# EAGLE design Card (EAGLE 9.6.2)
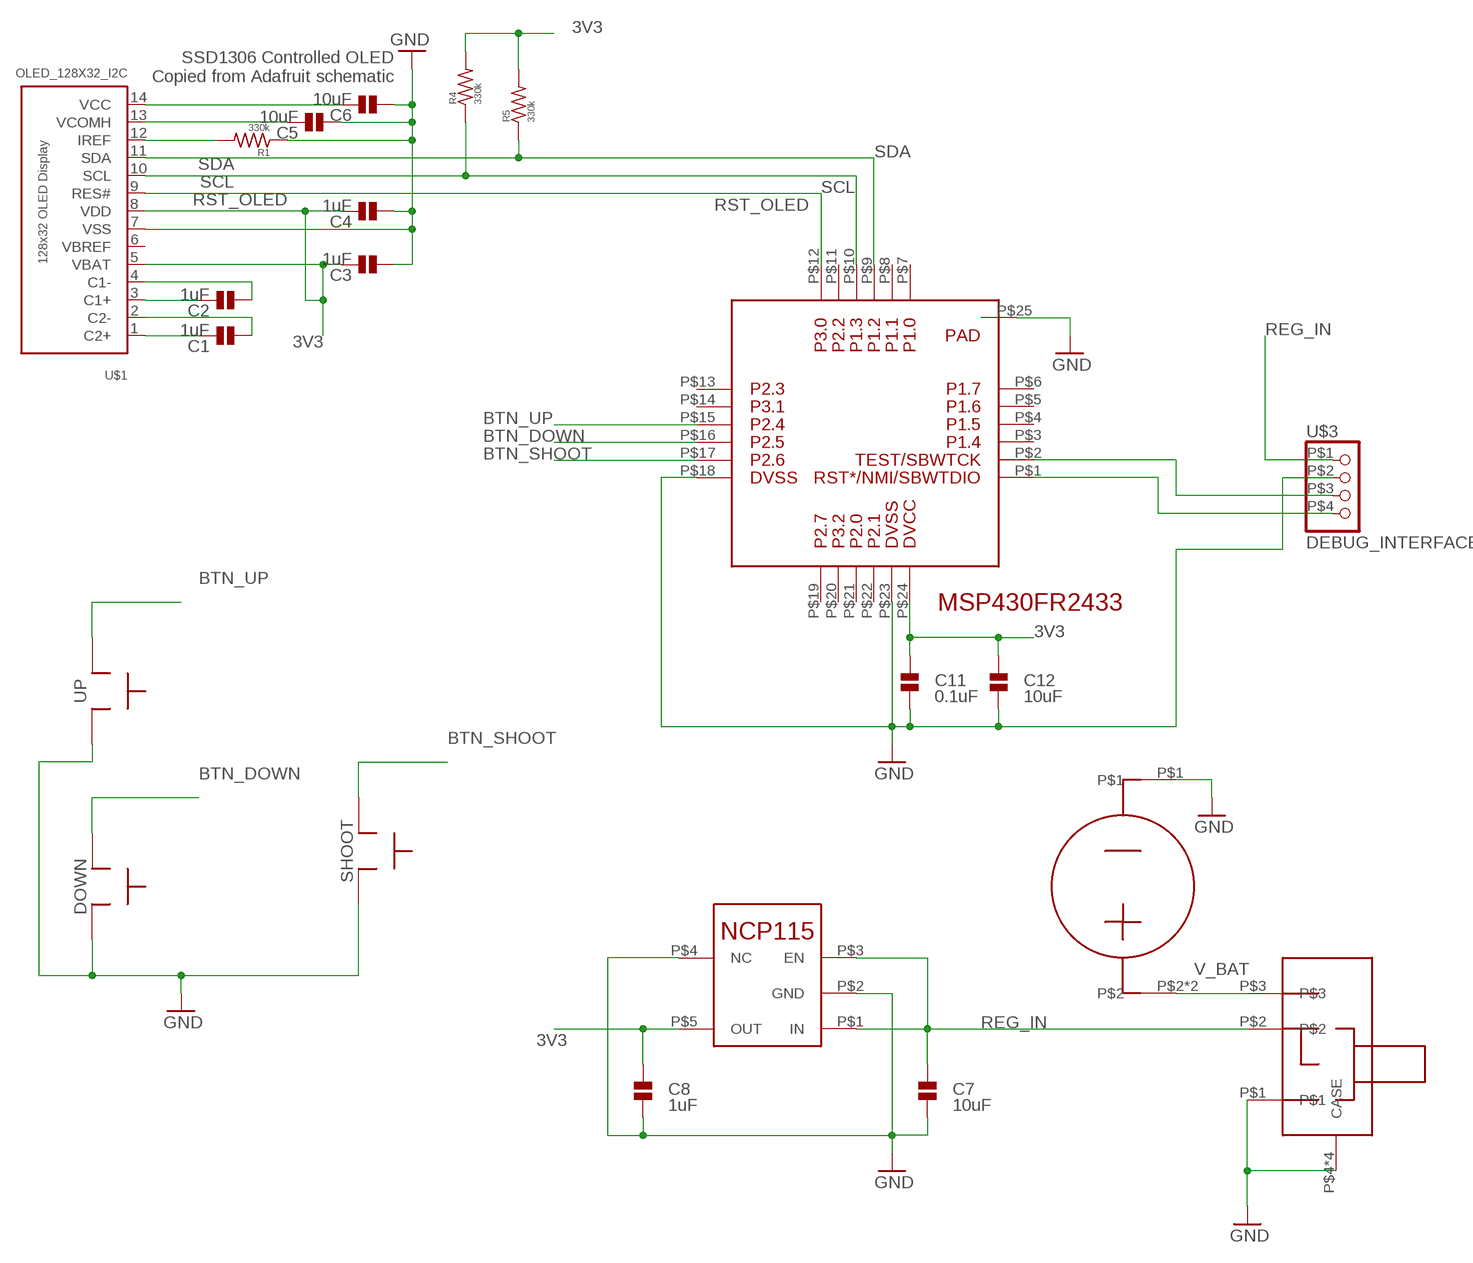
[diagram p0: schematic, sheet 1]

## Parts
C1  1uF  C-0603  [0603]
C2  1uF  C-0603  [0603]
C3  1uF  C-0603  [0603]
C4  1uF  C-0603  [0603]
C5  10uF  C-0603  [0603]
C6  10uF  C-0603  [0603]
C7  10uF  C-0603  [0603]
C8  1uF  C-0603  [0603]
C11  0.1uF  C-0603  [0603]
C12  10uF  C-0603  [0603]
DOWN  EVQ-Q2B02W  [EVQQ2]
R1  330k  R-0603  [0603]
R4  330k  R-0603  [0603]
R5  330k  R-0603  [0603]
SHOOT  EVQ-Q2B02W  [EVQQ2]
U$1  OLED_128X32_I2C  [OLED_I2C]
U$2  MSP430FR2433-VQFN  [VQFN-24]
U$3  DEBUG_INTERFACE  [DEBUG_INTERFACE_6PIN]
U$4  BAT-HLD-001  [BAT-HLD-001]
U$5  CUS-12TB  [CUS-12B]
U$6  NCP115  [TSOP-5]
UP  EVQ-Q2B02W  [EVQQ2]

## Nets
3V3: C3.2 C4.2 C8.2 C11.2 C12.2 R4.2 R5.2 U$1.5(VBAT) U$1.8(VDD) U$2.P$24 U$6.P$5(OUT)
BTN_DOWN: DOWN.P$1_A DOWN.P$2_A U$2.P$16
BTN_SHOOT: SHOOT.P$1_A SHOOT.P$2_A U$2.P$17
BTN_UP: U$2.P$15 UP.P$1_A UP.P$2_A
GND: C3.1 C4.1 C5.1 C6.1 C7.1 C8.1 C11.1 C12.1 DOWN.P$3_B DOWN.P$4_B R1.1 SHOOT.P$3_B SHOOT.P$4_B U$1.7(VSS) U$2.P$18 U$2.P$23 U$2.P$25 U$3.P$2 U$4.P$1 U$5.P$1 U$5.P$4(CASE) U$5.P$5(CASE) U$5.P$6(CASE) U$5.P$7(CASE) U$6.P$2(GND) U$6.P$4(NC) UP.P$3_B UP.P$4_B
N$1: C1.2 U$1.1(C2+)
N$2: C1.1 U$1.2(C2-)
N$3: C2.2 U$1.3(C1+)
N$4: C2.1 U$1.4(C1-)
N$5: U$2.P$2 U$3.P$3
N$6: U$2.P$1 U$3.P$4
N$7: R1.2 U$1.12(IREF)
N$8: C5.2 U$1.13(VCOMH)
N$9: C6.2 U$1.14(VCC)
REG_IN: C7.2 U$3.P$1 U$5.P$2 U$6.P$1(IN) U$6.P$3(EN)
RST_OLED: U$1.9(RES#) U$2.P$12
SCL: R4.1 U$1.10(SCL) U$2.P$10
SDA: R5.1 U$1.11(SDA) U$2.P$9
V_BAT: U$4.P$2 U$4.P$3 U$5.P$3
Unconnected: U$2.P$3 U$2.P$4 U$2.P$5 U$2.P$6 U$2.P$7 U$2.P$8 U$2.P$11 U$2.P$13 U$2.P$14 U$2.P$19 U$2.P$20 U$2.P$21 U$2.P$22

## Notes on the sheet
- SSD1306 Controlled OLED
  Copied from Adafruit schematic

## Power pins joined to a net without a drawn wire
VBREF: U$1.6(VBREF)

## Library data of the parts
C1-C8 C11 C12 = BusinessCard:C-0603
DOWN SHOOT UP = BusinessCard:EVQ-Q2B02W
R1 R4 R5 = BusinessCard:R-0603
U$1 = BusinessCard:OLED_128X32_I2C
U$2 = BusinessCard:MSP430FR2433-VQFN
U$3 = BusinessCard:DEBUG_INTERFACE
U$4 = BusinessCard:BAT-HLD-001: Holder for CR2016/2032 battery clip
U$5 = BusinessCard:CUS-12TB
U$6 = BusinessCard:NCP115

## Board
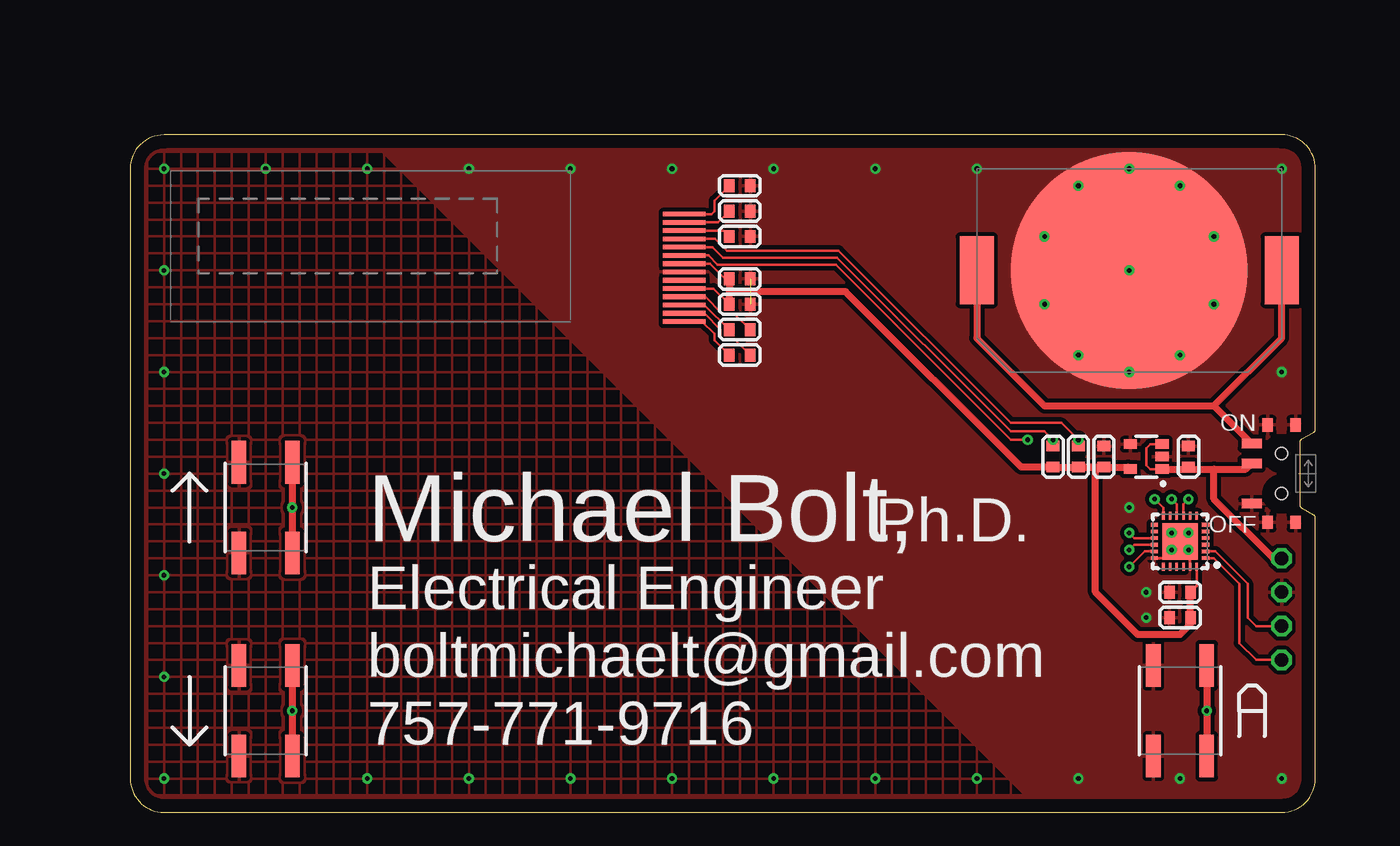
[diagram p1: board, top side]
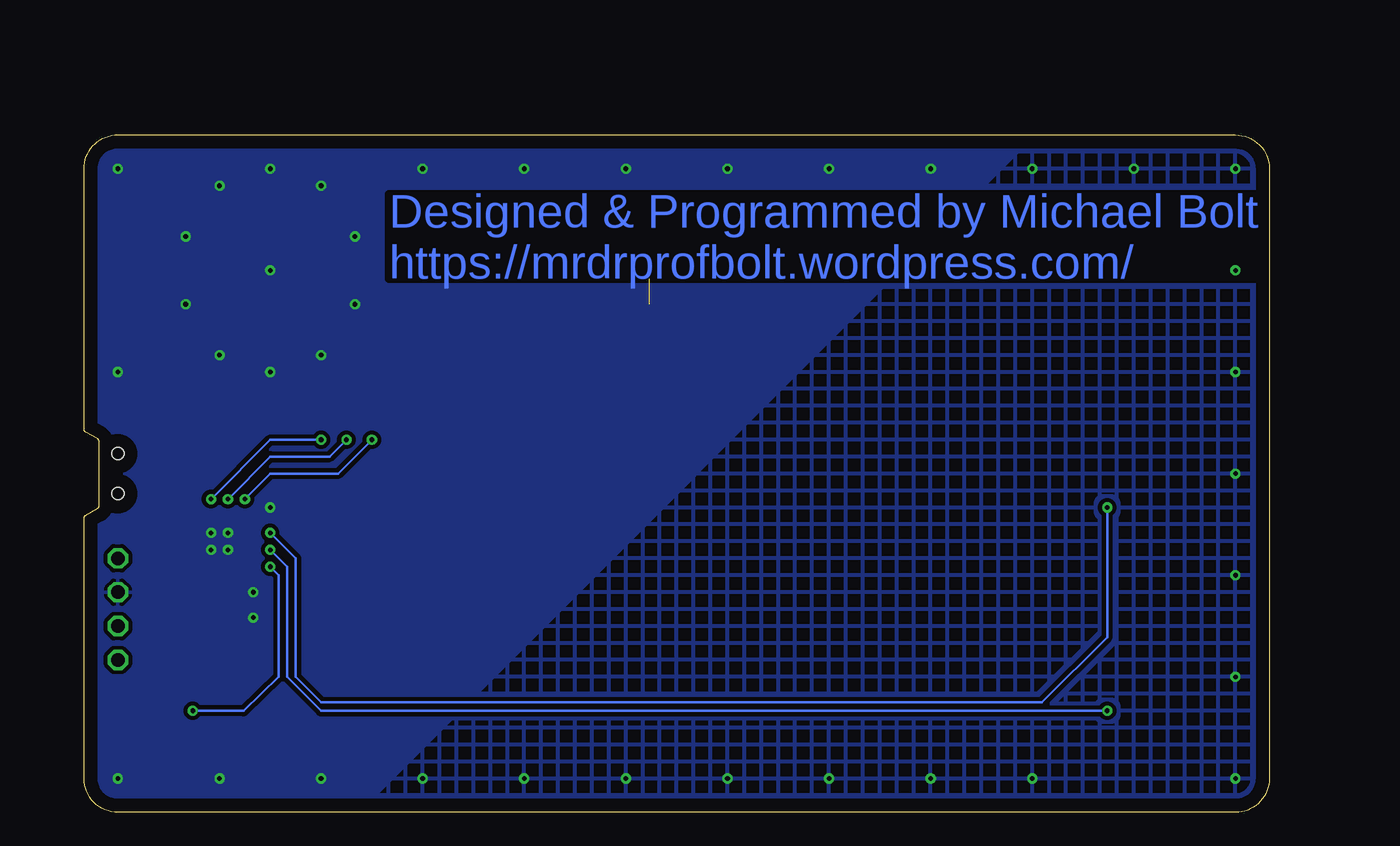
[diagram p2: board, bottom side, seen from below]

Size 88.9 x 50.8 mm. Coordinates in mm from the lower left corner, seen from the top.
Outline: 0,48.26 0,2.54 arc90 2.54,0 86.36,0 arc90 88.9,2.54 88.9,22.08 arc61 88.77,22.3 87.89,22.79 arc-61 87.76,23.01 87.76,27.79 arc-61 87.89,28.01 88.77,28.5 arc61 88.9,28.72 88.9,48.26 arc90 86.36,50.8 2.54,50.8 arc90 0,48.26
Copper layers (1*16): Top 0.035mm / dielectric 1.5mm / Bottom 0.035mm
Design rules "default *": minimum track width 6mil, minimum drill 0.35mm, track to track 6mil, track to pad 6mil, pad to pad 6mil, via to via 6mil, smd to smd 6mil, copper to edge 40mil, drill to drill 6mil, minimum pad ring 10mil, minimum via ring 8mil, stop-mask expansion 2mil, vias tented up to drill 14mil, thermal gap 10mil

### Footprints (pad centres in the part's own frame; a part is rotated, then mirrored left to right if it is on the bottom)
0603 = smd 0.787 x 0.965: 1 -0.787,0; 2 0.787,0
EVQQ2 = smd 3.2 x 1.1: P$1_A -3.4,-2; P$2_A 3.4,-2; P$3_B 3.4,2; P$4_B -3.4,2
OLED_I2C = smd 3.2 x 0.35: 1 8.53,-0.03; 2 8.53,0.59; 3 8.53,1.21; 4 8.53,1.83; 5 8.53,2.45; 6 8.53,3.07; 7 8.53,3.69; 8 8.53,4.31; 9 8.53,4.93; 10 8.53,5.55; 11 8.53,6.17; 12 8.53,6.79; 13 8.53,7.41; 14 8.53,8.03
VQFN-24 = smd 0.58 x 0.24: P$1 -1.913,1.25; P$2 -1.913,0.75; P$3 -1.913,0.25; P$4 -1.913,-0.25; P$5 -1.913,-0.75; P$6 -1.913,-1.25; P$13 1.913,-1.25; P$14 1.913,-0.75; P$15 1.913,-0.25; P$16 1.913,0.25; P$17 1.913,0.75; P$18 1.913,1.25 | smd 0.24 x 0.58: P$7 -1.25,-1.913; P$8 -0.75,-1.913; P$9 -0.25,-1.913; P$10 0.25,-1.913; P$11 0.75,-1.913; P$12 1.25,-1.913; P$19 1.25,1.913; P$20 0.75,1.913; P$21 0.25,1.913; P$22 -0.25,1.913; P$23 -0.75,1.913; P$24 -1.25,1.913 | smd 2.7 x 2.7: P$25 0,0
DEBUG_INTERFACE_6PIN = drill 1.016 octagon: P$1 -3.81,0; P$2 -1.27,0; P$3 1.27,0; P$4 3.81,0
BAT-HLD-001 = smd 17.78 x 17.78: P$1 0,0 | smd 2.54 x 5.08: P$2 11.43,0; P$3 -11.43,0
CUS-12B = smd 0.7 x 1.5: P$1 -2.25,2.25; P$2 0.75,2.25; P$3 2.25,2.25 | smd 1 x 0.8: P$4 -3.65,1.05; P$5 -3.65,-1.05; P$6 3.65,-1.05; P$7 3.65,1.05 | hole 0.9: -1.5,0; 1.5,0
TSOP-5 = smd 0.711 x 0.991: P$1 0.94,1.194; P$2 0,1.194; P$3 -0.94,1.194; P$4 -0.94,-1.194; P$5 0.94,-1.194

### Placement (x,y rotation side)
C1  45.72,34.29 180 top
C2  45.72,36.2 180 top
C3  45.72,40.01 180 top
C4  45.72,38.1 180 top
C5  45.72,45.09 180 top
C6  45.72,46.99 180 top
C7  79.38,26.67 270 top
C8  73.03,26.67 270 top
C11  78.74,14.61 0 top
C12  78.74,16.51 0 top
DOWN  10.16,7.62 90 top
R1  45.72,43.18 180 top
R4  69.22,26.67 270 top
R5  71.12,26.67 270 top
SHOOT  78.74,7.62 90 top
U$1  33.02,36.83 0 top
U$2  78.74,20.32 180 top
U$3  86.36,15.24 270 top
U$4  74.93,40.64 180 top
U$5  86.36,25.4 90 top
U$6  76.2,26.67 270 top
UP  10.16,22.86 90 top

### Tracks (layer width: path | path; a pad name or v marks a point on that pad's centre or on a via)
3V3
  Top 0.203: C12.2 79.99,16.97 U$2.P$24 | U$1.8 43.48,41.14 44.62,40.01 C3.2 | U$1.5 43.75,39.28 C4.2
  Top 0.508: C12.2 C11.2 79.53,14.12 78.74,13.34 75.56,13.34 72.39,16.51 72.39,25.88 | R5.2 R4.2 66.83,25.88 53.66,39.05 45.72,39.05 44.93,39.05 | R5.2 72.39,25.88 | 72.39,25.88 74.85,25.88 U$6.P$5 | C8.2 R5.2 | C4.2 44.93,39.05 | C3.2 44.93,39.05
BTN_DOWN  (via drill 0.35)
  Top 0.203: U$2.P$16 75.31,20.07 v74.93,19.68
  Top 0.508: DOWN.P$1_A v12.16,7.62 DOWN.P$2_A
  Bottom 0.203: v74.93,19.68 73.66,18.41 73.66,10.16 71.12,7.62 v12.16,7.62
BTN_SHOOT  (via drill 0.35)
  Top 0.203: U$2.P$17 76.08,19.57 v74.93,18.41
  Top 0.508: SHOOT.P$2_A v80.74,7.62 SHOOT.P$1_A
  Bottom 0.203: v74.93,18.41 74.3,17.78 74.3,10.16 76.93,7.62 v80.74,7.62
BTN_UP  (via drill 0.35)
  Top 0.203: U$2.P$15 75.31,20.57 v74.93,20.95
  Top 0.508: UP.P$1_A v12.16,22.86 UP.P$2_A
  Bottom 0.203: v74.93,20.95 73.03,19.05 73.03,10.16 71.12,8.26 17.05,8.26 12.16,13.14 v12.16,22.86
GND  (via drill 0.35)  (1 unrouted)
  Top 0.203: U$2.P$18 77.49,19.07 U$2.P$25 79.49,19.57 U$2.P$23
  other vias: 86.36,2.54 86.36,48.26 2.54,48.26 2.54,2.54 2.54,40.64 2.54,33.02 2.54,25.4 2.54,17.78 2.54,10.16 86.36,33.02 10.16,48.26 17.78,48.26 25.4,48.26 33.02,48.26 40.64,48.26 48.26,48.26 55.88,48.26 63.5,48.26 68.58,43.18 81.28,43.18 71.12,34.29 78.74,34.29 74.93,40.64 74.93,33.02 71.12,46.99 78.74,46.99 74.93,48.26 81.28,38.1 68.58,38.1 76.2,14.61 76.2,16.51 74.93,22.86 17.78,2.54 25.4,2.54 33.02,2.54 40.64,2.54 48.26,2.54 55.88,2.54 63.5,2.54 71.12,2.54 78.74,2.54 78.11,20.95 79.38,20.95 79.38,19.68 78.11,19.68
  pour Top (isolate 0.305): 88.9,-2.54 71.12,-2.54 15.24,53.34 91.44,53.34 91.44,0
  pour Top (isolate 0.305, hatched): 15.24,53.34 71.12,-2.54 0,-2.54 -2.54,0 -2.54,53.34
  pour Bottom (isolate 0.305): 15.24,53.34 71.12,-2.54 88.9,-2.54 91.44,0 91.44,53.34
  pour Bottom (isolate 0.305, hatched): 15.24,53.34 71.12,-2.54 0,-2.54 -2.54,0 -2.54,53.34
N$1
  Top 0.203: C1.2 43.81,35.41 43.81,35.88 42.89,36.8 U$1.1
N$2
  Top 0.203: C1.1 45.34,35.46 44.43,35.46 44.28,35.61 44.28,36.2 43.06,37.42 U$1.2
N$3
  Top 0.203: U$1.3 43.09,38.04 C2.2
N$4
  Top 0.203: C2.1 45.34,37.36 44.43,37.36 43.06,38.73 41.62,38.73 U$1.4
N$5
  Top 0.203: U$2.P$2 81.39,19.57 83.82,17.14 83.82,14.61 84.45,13.97 U$3.P$3
N$6
  Top 0.203: U$2.P$1 81.26,19.07 83.19,17.14 83.19,12.7 84.45,11.43 U$3.P$4
N$7
  Top 0.203: U$1.12 44.49,43.62 R1.2
N$8
  Top 0.203: U$1.13 44.09,44.24 C5.2
N$9
  Top 0.203: U$1.14 43.59,44.86 43.81,45.09 43.81,45.87 C6.2
REG_IN
  Top 0.203: U$6.P$1 76.5,25.73 76.2,26.04 76.2,27.3 76.5,27.61 U$6.P$3
  Top 0.508: C7.2 79.22,25.73 U$6.P$1 81.28,25.73 | 81.28,25.73 83.69,25.73 U$5.P$2 | U$3.P$1 85.72,19.05 81.28,23.5 81.28,25.73
RST_OLED  (via drill 0.35)
  Top 0.203: U$2.P$12 77.49,22.84 v76.83,23.5 | v67.31,27.94 66.04,27.94 52.92,41.06 44.06,41.06 43.36,41.76 U$1.9
  Bottom 0.203: v67.31,27.94 69.85,25.4 74.93,25.4 v76.83,23.5
SCL  (via drill 0.35)
  Top 0.203: U$2.P$10 78.49,23.11 v78.11,23.5 | R4.1 v69.22,27.94 68.58,28.57 66.04,28.57 53.02,41.59 44.45,41.59 43.66,42.38 U$1.10
  Bottom 0.203: v78.11,23.5 74.93,26.67 70.48,26.67 v69.22,27.94
SDA  (via drill 0.35)
  Top 0.203: U$2.P$9 78.99,23.11 v79.38,23.5 | R5.1 v71.12,27.94 69.85,29.21 66.04,29.21 53.12,42.13 44.75,42.13 43.88,43 U$1.11
  Bottom 0.203: v79.38,23.5 74.93,27.94 v71.12,27.94
V_BAT
  Top 0.508: U$4.P$2 63.5,35.56 68.58,30.48 81.28,30.48 | 81.28,30.48 86.36,35.56 U$4.P$3 | U$5.P$3 81.28,30.48

### Text on the board
Bottom: Designed & Programmed by Michael Bolt / https://mrdrprofbolt.wordpress.com/
tPlace: ON | OFF | Michael Bolt, | Ph.D. | Electrical Engineer | boltmichaelt@gmail.com | 757-771-9716